# Altium schematic sheet Wifi.SchDoc
size A4
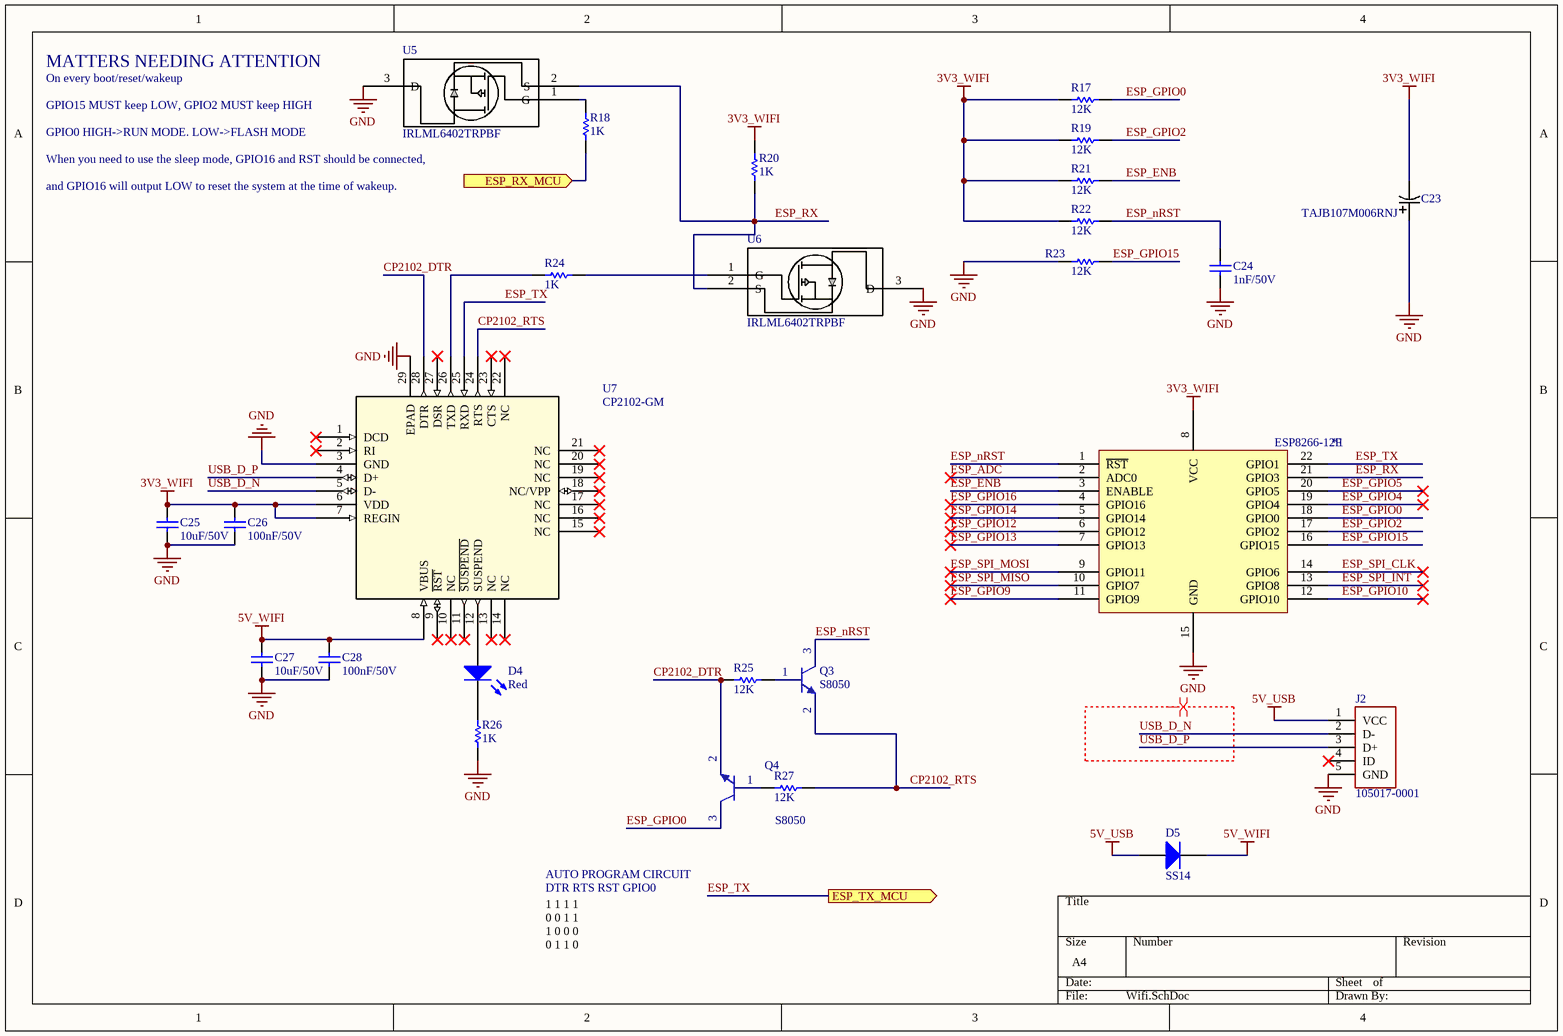
[diagram p0: Wifi.SchDoc]

## Parts
*1  ESP8266-12F  [ESP8266]
C23  TAJB107M006RNJ  [TAJB107M006RNJ]
C24  value 1nF/50V  [CAP-SM-0805]  (hidden comment: Cap-1nF-50V-0805)
C25  value 10uF/50V  [CAP-SM-0805]  (hidden comment: Cap-1nF-50V-0805)
C26  value 100nF/50V  [CAP-SM-0805]  (hidden comment: Cap-1nF-50V-0805)
C27  value 10uF/50V  [CAP-SM-0805]  (hidden comment: Cap-1nF-50V-0805)
C28  value 100nF/50V  [CAP-SM-0805]  (hidden comment: Cap-1nF-50V-0805)
D4  value Red  [LED-3mm]  (hidden comment: LED-RED-TH-3mm)
D5  SS14  [SS14]
J2  105017-0001  [CONN_105017-0001]
Q3  S8050  [SOT23_NEX]
Q4  S8050  [SOT23_NEX]
R17  value 12K  [RES-SM-0805]  (hidden comment: Res-0-0805)
R18  value 1K  [RES-SM-0805]  (hidden comment: Res-470-0805)
R19  value 12K  [RES-SM-0805]  (hidden comment: Res-0-0805)
R20  value 1K  [RES-SM-0805]  (hidden comment: Res-470-0805)
R21  value 12K  [RES-SM-0805]  (hidden comment: Res-0-0805)
R22  value 12K  [RES-SM-0805]  (hidden comment: Res-0-0805)
R23  value 12K  [RES-SM-0805]  (hidden comment: Res-0-0805)
R24  value 1K  [RES-SM-0805]  (hidden comment: Res-470-0805)
R25  value 12K  [RES-SM-0805]  (hidden comment: Res-0-0805)
R26  value 1K  [RES-SM-0805]  (hidden comment: Res-470-0805)
R27  value 12K  [RES-SM-0805]  (hidden comment: Res-0-0805)
U5  IRLML6402TRPBF  [IRLML6402TRPBF]
U6  IRLML6402TRPBF  [IRLML6402TRPBF]
U7  CP2102-GM  [cp2102-gm]

## Ports
ESP_RX_MCU (in), ESP_TX_MCU (out)

## Nets
3V3_WIFI: *1.8(VCC) C23.2 C25.2 C26.2 R17.1 R19.1 R20.1 R21.1 R22.1 U7.6(VDD) U7.7(REGIN)
5V_USB: D5.2(A) J2.1(VCC)
5V_WIFI: C27.2 C28.2 D5.1(K) U7.8(VBUS)
GND: *1.15(GND) C23.1 C24.1 C25.1 C26.1 C27.1 C28.1 J2.5(GND) R23.1 R26.1 U5.3(D) U6.3(D) U7.3(GND) U7.29(EPAD)
CP2102_DTR: Q4.2(E) R25.1 U7.28(DTR)
CP2102_RTS: Q3.2(E) R27.2 U7.24(RTS)
ESP_ADC: *1.2(ADC0)
ESP_ENB: *1.3(ENABLE) R21.2
ESP_GPIO0: *1.18(GPIO0) Q4.3(C) R17.2
ESP_GPIO2: *1.17(GPIO2) R19.2
ESP_GPIO4: *1.19(GPIO4)
ESP_GPIO5: *1.20(GPIO5)
ESP_GPIO9: *1.11(GPIO9)
ESP_GPIO10: *1.12(GPIO10)
ESP_GPIO12: *1.6(GPIO12)
ESP_GPIO13: *1.7(GPIO13)
ESP_GPIO14: *1.5(GPIO14)
ESP_GPIO15: *1.16(GPIO15) R23.2
ESP_GPIO16: *1.4(GPIO16)
ESP_nRST: *1.1(~{RST}) C24.2 Q3.3(C) R22.2
ESP_RX: *1.21(GPIO3) R20.2 U5.2(S) U6.2(S)
ESP_RX_MCU: R18.1 ; port ESP_RX_MCU
ESP_SPI_CLK: *1.14(GPIO6)
ESP_SPI_INT: *1.13(GPIO8)
ESP_SPI_MISO: *1.10(GPIO7)
ESP_SPI_MOSI: *1.9(GPIO11)
ESP_TX: *1.22(GPIO1) U7.25(RXD) ; port ESP_TX_MCU
USB_D_N: J2.2(D-) U7.5(D-)
USB_D_P: J2.3(D+) U7.4(D+)
NetD4_1: D4.1(A) U7.12(SUSPEND)
NetD4_2: D4.2(K) R26.2
NetQ3_1: Q3.1(B) R25.2
NetQ4_1: Q4.1(B) R27.1
NetR18_2: R18.2 U5.1(G)
NetR24_1: R24.1 U6.1(G)
NetR24_2: R24.2 U7.26(TXD)

Not connected (* = marked no-connect by the designer): J2 4(ID)*; U7 1(DCD)* 2(RI)* 9(~{RST})* 10(NC)* 11(~{SUSP}~{END})* 13(NC)* 14(NC)* 15(NC)* 16(NC)* 17(NC)* 18(NC/VPP)* 19(NC)* 20(NC)* 21(NC)* 22(NC)* 23(CTS)* 27(DSR)*

## Layout directives
differential pair: (no net found under the mark)

## Notes on the sheet
- MATTERS NEEDING ATTENTION
- On every boot/reset/wakeup
- GPIO15 MUST keep LOW, GPIO2 MUST keep HIGH
- GPIO0 HIGH->RUN MODE. LOW->FLASH MODE
- When you need to use the sleep mode, GPIO16 and RST should be connected,
- and GPIO16 will output LOW to reset the system at the time of wakeup.
- AUTO PROGRAM CIRCUIT
- DTR RTS RST GPIO0
- 1 1 1 1
  0 0 1 1
  1 0 0 0
  0 1 1 0

## Library data of the parts
*1 = ESP8266-12F: Local supply: Hshop; Local supply link: https://www.elecrow.com/download/ESP-12F.pdf
C23 = TAJB107M006RNJ: Vendor: AVX Corporation; Built_By: EMA_UL_Team; SourceLibrary: AVX_2015-1-12; Type: DEV; Manufacturer_Part_Number: TAJB107M006RNJ; Copyright: Copyright (C) 2018 Accelerated Designs. All rights reserved; RefDes: RefDes
C24-C28 = Cap-1nF-50V-0805: CAP CER 1000PF 100V X7R 0805; Manufacturer: Johanson Dielectrics Inc.; Manufacturer Part Number: 101X15W102MV4E; Local Supplier: thegioiic; Local Supplier Link: https://thegioiic.com/products/tu-1nf-50v-0805; Supplier 1: Digikey; Supplier 1 Link: https://www.digikey.com/product-detail/en/johanson-dielectrics-inc/101X15W102MV4E/709-1335-1-ND/2327235; Supplier 1 Part Number: 709-1335-1-ND
D4 = LED-RED-TH-3mm: LED RED CLEAR T-1 T/H; Manufacturer: Kingbright; Manufacturer Part Number: WP710A10SEC/J3; Local Supplier: thegioiic; Local Supplier Link: https://thegioiic.com/products/led-do-3mm-chan-dai; Supplier 1: Digikey; Supplier 1 Link: https://www.digikey.com/product-detail/en/kingbright/WP710A10SEC-J3/754-1589-ND/2769815; Supplier 1 Part Number: 754-1589-ND
D5 = Diode-SS14: DIODE SCHOTTKY 40V 1A SMA; Manufacturer: ON Semiconductor; Local Supplier: thegioiic; Local Supplier Link: https://thegioiic.com/products/ss14-sma; Supplier 1: Digikey; Supplier 1 Link: https://www.digikey.com/product-detail/en/on-semiconductor/SS14/SS14CT-ND/965729; Manufacturer Part Number: SS14; Supplier 1 Part Number: SS14CT-ND
J2 = 105017-0001: No Description Available; Vendor: Molex Connector Corporation; Built_By: EMA_Cory; SourceLibrary: Molex_2020-05-26; Datasheet: https://www.molex.com/pdm_docs/sd/1050170001_sd.pdf; Manufacturer_Part_Number: 105017-0001; Copyright: Copyright (C) 2018 Accelerated Designs. All rights reserved; RefDes: RefDes; Type: DEV
R17 R19 R21-R23 R25 R27 = Res-0-0805: RES 0 OHM JUMPER 0805; Manufacturer: Vishay Dale; Manufacturer Part Number: WSL080500000ZEA9; Local Supplier: thegioiic; Local Supplier Link: https://thegioiic.com/products/dien-tro-0-ohm-0805-5; Supplier 1: Digikey; Supplier 1 Link: https://www.digikey.com/product-detail/en/vishay-dale/WSL080500000ZEA9/541-3928-1-ND/7423223; Supplier 1 Part Number: 541-3928-1-ND
R18 R20 R24 R26 = Res-470-0805: RES 470 OHM JUMPER 0805; Manufacturer: YAG6006CT-ND; Manufacturer Part Number: PE0805FRF7W0R047L; Local Supplier: thegioiic; Local Supplier Link: https://www.thegioiic.com/products/dien-tro-470-kohm-0805-5; Supplier 1: Digikey; Supplier 1 Link: https://www.digikey.com/product-detail/en/yageo/PE0805FRF7W0R047L/YAG6006CT-ND/9696460; Supplier 1 Part Number: YAG6006CT-ND
U5 U6 = IRLML6402TRPBF: No Description Available; Source_Library: Infineon_2020-02-27.xlr; Built_By: EMA_Justin; SourceLibrary: Infineon_2020-02-27; Vendor: Infineon; Copyright: Copyright (C) 2018 Accelerated Designs. All rights reserved; Manufacturer_Part_Number: IRLML6402TRPBF; RefDes: RefDes; Type: DEV
U7 = CP2102-GM: Vendor: Silicon Labs; Built_By: EMA_UL_Team; SourceLibrary: Silicon_Labs_2015-03-23; Manufacturer_Part_Number: CP2102-GM; Copyright: Copyright (C) 2018 Accelerated Designs. All rights reserved; RefDes: RefDes; Type: DEV